# Altium schematic sheet TVR_Rev1.SchDoc
size 381 x 241 mm; SheetNumber: 1; SheetTotal: 1
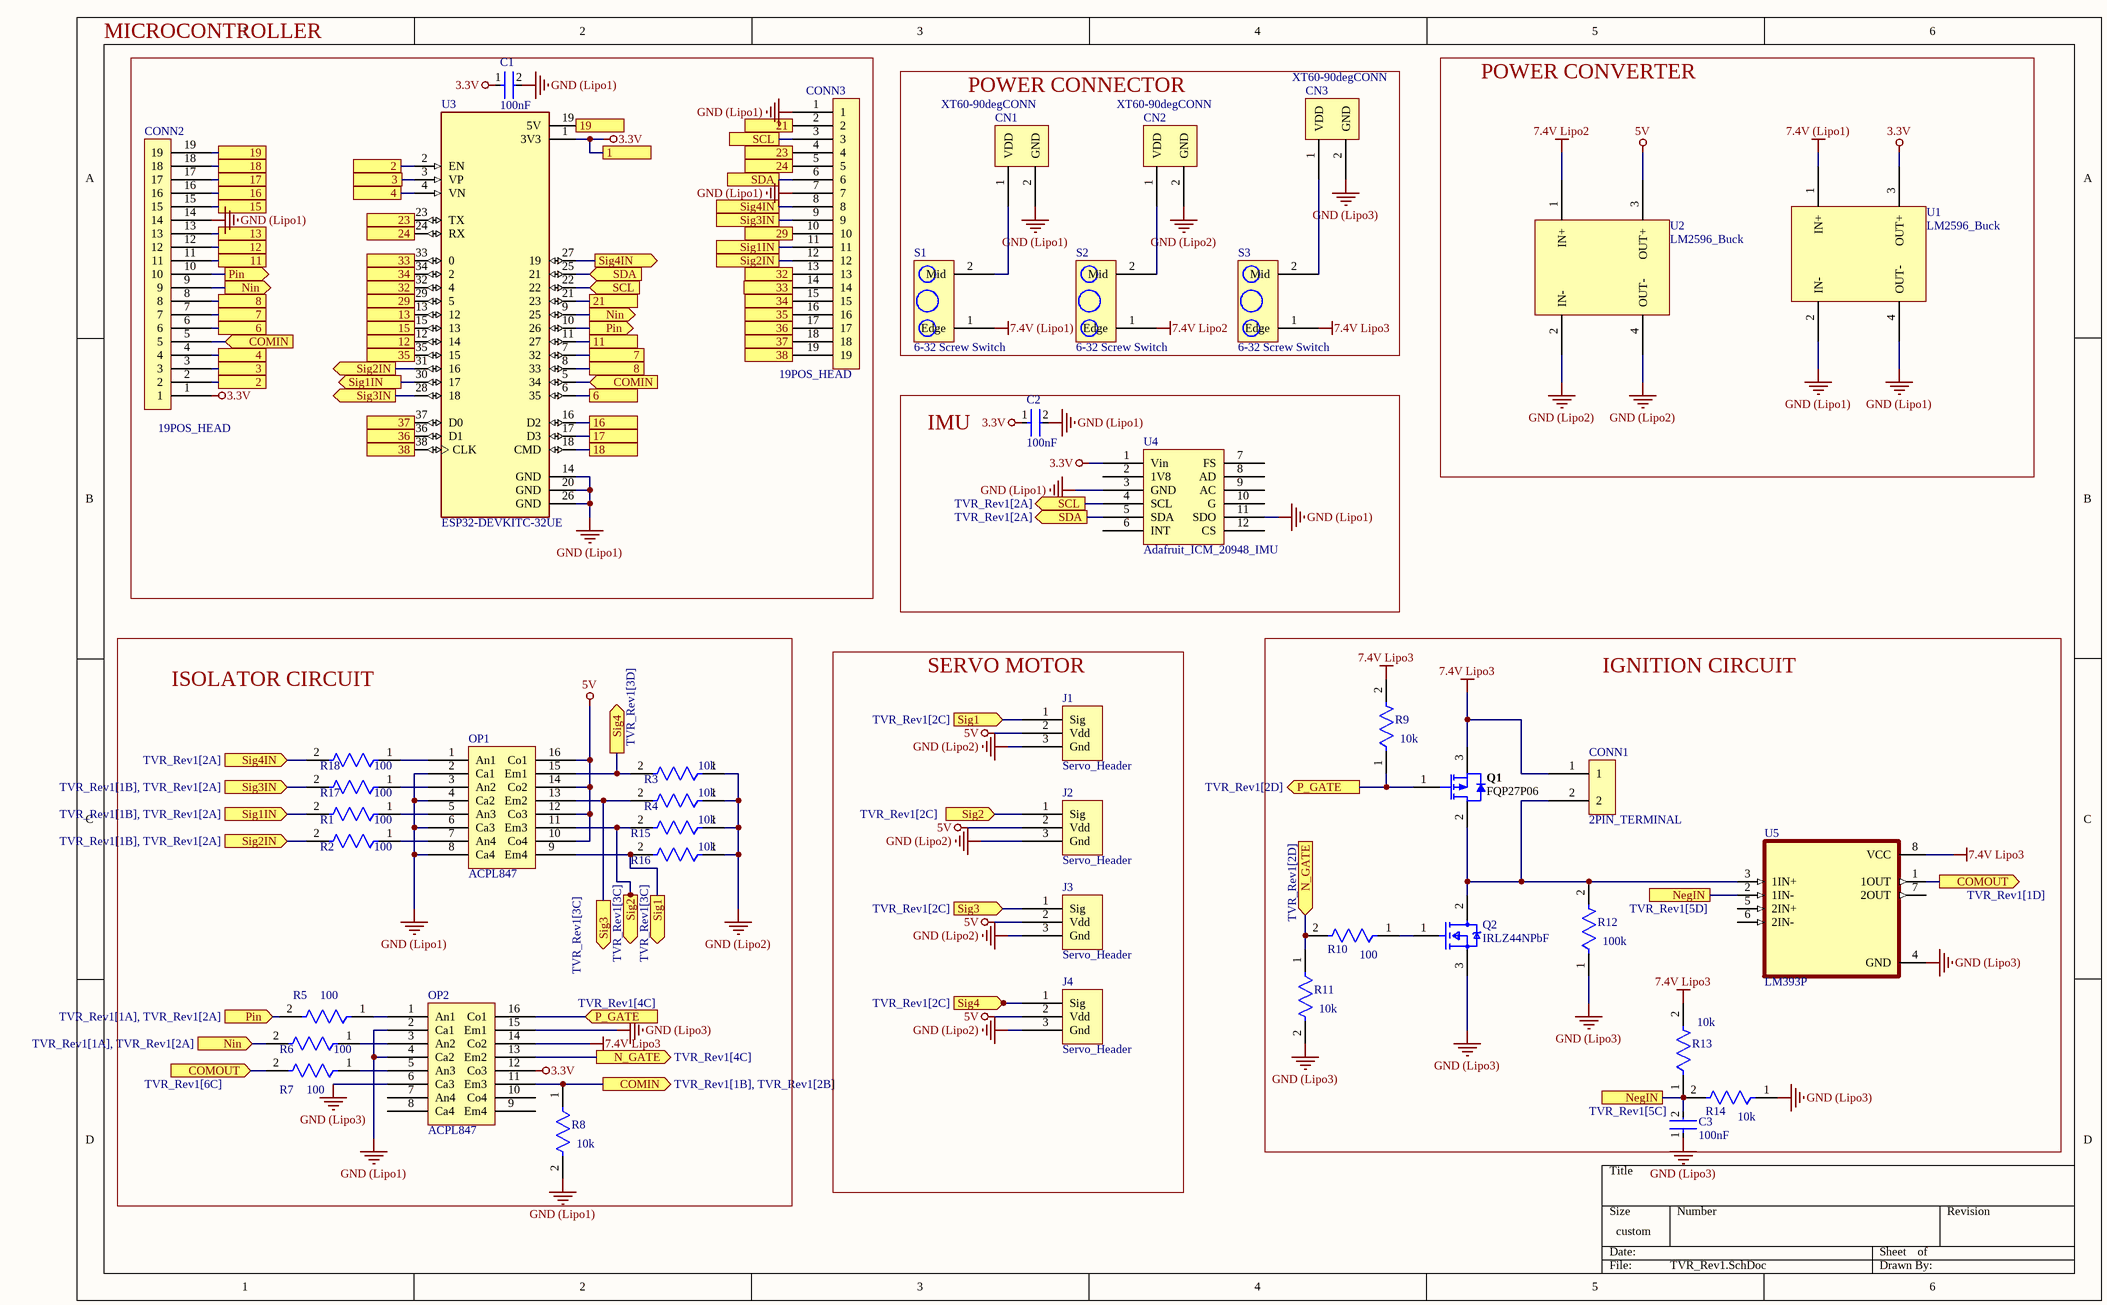
[diagram p0: TVR_Rev1.SchDoc]

## Parts
C1  100nF  [FP-RDE0M1-MFG]
C2  100nF  [FP-RDE0M1-MFG]
C3  100nF  [FP-RDE0M1-MFG]
CN1  XT60-90degCONN  [XT60-90CONN]
CN2  XT60-90degCONN  [XT60-90CONN]
CN3  XT60-90degCONN  [XT60-90CONN]
CONN1  2PIN_TERMINAL  [2PIN_TERMINAL]
CONN2  19POS_HEAD  [19POS_HEAD]
CONN3  19POS_HEAD  [19POS_HEAD]
J1  Servo_Header  [ServoHeader]
J2  Servo_Header  [ServoHeader]
J3  Servo_Header  [ServoHeader]
J4  Servo_Header  [ServoHeader]
OP1  ACPL847  [8PIN_DIP]
OP2  ACPL847  [8PIN_DIP]
Q1  FQP27P06  [FAIR-TO-220-3]
Q2  IRLZ44NPbF  [FP-PG-TO220-3-MFG]
R1  100  [FP-RLR07-MFG]
R2  100  [FP-RLR07-MFG]
R3  10k  [FP-RLR07-MFG]
R4  10k  [FP-RLR07-MFG]
R5  100  [FP-RLR07-MFG]
R6  100  [FP-RLR07-MFG]
R7  100  [FP-RLR07-MFG]
R8  10k  [FP-RLR07-MFG]
R9  10k  [FP-RLR07-MFG]
R10  100  [FP-RLR07-MFG]
R11  10k  [FP-RLR07-MFG]
R12  100k  [FP-RLR07-MFG]
R13  10k  [FP-RLR07-MFG]
R14  10k  [FP-RLR07-MFG]
R15  10k  [FP-RLR07-MFG]
R16  10k  [FP-RLR07-MFG]
R17  100  [FP-RLR07-MFG]
R18  100  [FP-RLR07-MFG]
S1  6-32 Screw Switch  [6-32 Screw Switch]
S2  6-32 Screw Switch  [6-32 Screw Switch]
S3  6-32 Screw Switch  [6-32 Screw Switch]
U1  LM2596_Buck  [LM2596 Buck]
U2  LM2596_Buck  [LM2596 Buck]
U3  ESP32-DEVKITC-32UE  [ESPRESSIF_ESP32-DEVKITC-32UE]
U4  Adafruit_ICM_20948_IMU  [Adafruit_ICM_20948_IMU]
U5  LM393P  [DIP794W45P254L959H508Q8]

## Blocks framed on the sheet
POWER CONNECTOR: CN1-CN3 S1-S3
POWER CONVERTER: U1 U2
IMU: C2 U4
ISOLATOR CIRCUIT: OP1 OP2 R1-R8 R15-R18
SERVO MOTOR: J1-J4
IGNITION CIRCUIT: C3 CONN1 Q1 Q2 R9-R14 U5

## Ports
1, 2 (see TVR_Rev1[1A]), 2 (see TVR_Rev1[1B]), 3 (see TVR_Rev1[1A]), 3 (see TVR_Rev1[1B]), 4 (see TVR_Rev1[1A]), 4 (see TVR_Rev1[1B]), 6 (see TVR_Rev1[1A]), 6 (see TVR_Rev1[2B]), 7 (see TVR_Rev1[1A]), 7 (see TVR_Rev1[2B]), 8 (see TVR_Rev1[1A]), 8 (see TVR_Rev1[2B]), 11 (see TVR_Rev1[1A]), 11 (see TVR_Rev1[2B]), 12 (see TVR_Rev1[1A]), 12 (see TVR_Rev1[1B]), 13 (see TVR_Rev1[1A]), 15 (see TVR_Rev1[1A]), 16 (see TVR_Rev1[1A]), 16 (see TVR_Rev1[2B]), 17 (see TVR_Rev1[1A]), 17 (see TVR_Rev1[2B]), 18 (see TVR_Rev1[1A]), 18 (see TVR_Rev1[2B]), 19 (see TVR_Rev1[1A]), 19 (see TVR_Rev1[2A]), 21 (see TVR_Rev1[2A]), 23 (see TVR_Rev1[1A]), 23 (see TVR_Rev1[2A]), 24 (see TVR_Rev1[1A]), 24 (see TVR_Rev1[2A]), 29 (see TVR_Rev1[1A]), 29 (see TVR_Rev1[2A]), 32 (see TVR_Rev1[1A]), 32 (see TVR_Rev1[2A]), 33 (see TVR_Rev1[1A]), 33 (see TVR_Rev1[2A]), 34 (see TVR_Rev1[1A]), 34 (see TVR_Rev1[2A]), 35 (see TVR_Rev1[1B]), 35 (see TVR_Rev1[2A]), 36 (see TVR_Rev1[1B]), 36 (see TVR_Rev1[2A]), 37 (see TVR_Rev1[1B]), 37 (see TVR_Rev1[2B]), 38 (see TVR_Rev1[1B]), 38 (see TVR_Rev1[2B]), COMIN (in, see TVR_Rev1[1B], TVR_Rev1[2D]), COMIN (in, see TVR_Rev1[2B], TVR_Rev1[2D]), COMIN (out, see TVR_Rev1[1B], TVR_Rev1[2B]), COMOUT (in, see TVR_Rev1[6C]), COMOUT (out, see TVR_Rev1[1D]), N_GATE (in, see TVR_Rev1[2D]), N_GATE (out, see TVR_Rev1[4C]), NegIN (see TVR_Rev1[5C]), NegIN (see TVR_Rev1[5D]), Nin (in, see TVR_Rev1[1A], TVR_Rev1[2A]), Nin (out, see TVR_Rev1[1A], TVR_Rev1[1D]), Nin (out, see TVR_Rev1[1D], TVR_Rev1[2A]), P_GATE (in, see TVR_Rev1[4C]), P_GATE (out, see TVR_Rev1[2D]), Pin (in, see TVR_Rev1[1A], TVR_Rev1[2A]), Pin (out, see TVR_Rev1[1A], TVR_Rev1[1D]), Pin (out, see TVR_Rev1[1D], TVR_Rev1[2A]), SCL (in, see TVR_Rev1[2A], TVR_Rev1[3B]), SCL (out, see TVR_Rev1[2A]), SCL (see TVR_Rev1[2A], TVR_Rev1[3B]), SDA (in, see TVR_Rev1[2A], TVR_Rev1[3B]), SDA (out, see TVR_Rev1[2A]), SDA (see TVR_Rev1[2A], TVR_Rev1[3B]), Sig1 (in, see TVR_Rev1[2C]), Sig1 (out, see TVR_Rev1[3C]), Sig1IN (in, see TVR_Rev1[1B], TVR_Rev1[2A]), Sig1IN (out, see TVR_Rev1[1C], TVR_Rev1[2A]), Sig1IN (see TVR_Rev1[1B], TVR_Rev1[1C]), Sig2 (in, see TVR_Rev1[2C]), Sig2 (out, see TVR_Rev1[3C]), Sig2IN (in, see TVR_Rev1[1B], TVR_Rev1[2A]), Sig2IN (out, see TVR_Rev1[1C], TVR_Rev1[2A]), Sig2IN (see TVR_Rev1[1B], TVR_Rev1[1C]), Sig3 (in, see TVR_Rev1[2C]), Sig3 (out, see TVR_Rev1[3C]), Sig3IN (in, see TVR_Rev1[1B], TVR_Rev1[2A]), Sig3IN (out, see TVR_Rev1[1C], TVR_Rev1[2A]), Sig3IN (see TVR_Rev1[1B], TVR_Rev1[1C]), Sig4 (in, see TVR_Rev1[2C]), Sig4 (out, see TVR_Rev1[3D]), Sig4IN (in, see TVR_Rev1[2A]), Sig4IN (out, see TVR_Rev1[1C], TVR_Rev1[2A]), Sig4IN (see TVR_Rev1[1C], TVR_Rev1[2A])

## Nets
3.3V: C1.1 C2.1 CONN2.1 OP2.12(Co3) U1.3(OUT+) U3.1(3V3) U4.1(Vin) ; port 1
5V: J1.2(Vdd) J2.2(Vdd) J3.2(Vdd) J4.2(Vdd) OP1.10(Co4) OP1.12(Co3) OP1.14(Co2) OP1.16(Co1) U2.3(OUT+)
7.4V (Lipo1): S1.1(Edge) U1.1(IN+)
7.4V Lipo2: S2.1(Edge) U2.1(IN+)
7.4V Lipo3: CONN1.1 OP2.14(Co2) Q1.3(S) R9.2 R13.2 S3.1(Edge) U5.8(VCC)
GND (Lipo1): C1.2 C2.2 CN1.2(GND) CONN2.14 CONN3.1 CONN3.7 OP1.2(Ca1) OP1.4(Ca2) OP1.6(Ca3) OP1.8(Ca4) OP2.2(Ca1) OP2.4(Ca2) R8.2 U1.2(IN-) U1.4(OUT-) U3.14(GND) U3.20(GND) U3.26(GND) U4.3(GND) U4.11(SDO)
GND (Lipo2): CN2.2(GND) J1.3(Gnd) J2.3(Gnd) J3.3(Gnd) J4.3(Gnd) R3.1 R4.1 R15.1 R16.1 U2.2(IN-) U2.4(OUT-)
GND (Lipo3): C3.1 CN3.2(GND) OP2.6(Ca3) OP2.15(Em1) Q2.3(S) R11.2 R12.1 R14.1 U5.4(GND)
2: CONN2.2 U3.2(EN) ; port 2
3: CONN2.3 U3.3(VP) ; port 3
4: CONN2.4 U3.4(VN) ; port 4
6: CONN2.6 U3.6(35) ; port 6
7: CONN2.7 U3.7(32) ; port 7
8: CONN2.8 U3.8(33) ; port 8
11: CONN2.11 U3.11(27) ; port 11
12: CONN2.12 U3.12(14) ; port 12
13: CONN2.13 U3.13(12) ; port 13
15: CONN2.15 U3.15(13) ; port 15
16: CONN2.16 U3.16(D2) ; port 16
17: CONN2.17 U3.17(D3) ; port 17
18: CONN2.18 U3.18(CMD) ; port 18
19: CONN2.19 U3.19(5V) ; port 19
21: CONN3.2 U3.21(23) ; port 21
23: CONN3.4 U3.23(TX) ; port 23
24: CONN3.5 U3.24(RX) ; port 24
29: CONN3.10 U3.29(5) ; port 29
32: CONN3.13 U3.32(4) ; port 32
33: CONN3.14 U3.33(0) ; port 33
34: CONN3.15 U3.34(2) ; port 34
35: CONN3.16 U3.35(15) ; port 35
36: CONN3.17 U3.36(D1) ; port 36
37: CONN3.18 U3.37(D0) ; port 37
38: CONN3.19 U3.38(CLK) ; port 38
COMIN: CONN2.5 OP2.11(Em3) R8.1 U3.5(34) ; port COMIN
COMOUT: R7.2 U5.1(1OUT) ; port COMOUT
N_GATE: OP2.13(Em2) R10.2 R11.1 ; port N_GATE
NegIN: C3.2 R13.1 R14.2 U5.2(1IN-) ; port NegIN
Nin: CONN2.9 R6.2 U3.9(25) ; port Nin
P_GATE: OP2.16(Co1) Q1.1(G) R9.1 ; port P_GATE
Pin: CONN2.10 R5.2 U3.10(26) ; port Pin
SCL: CONN3.3 U3.22 U4.4(SCL) ; port SCL
SDA: CONN3.6 U3.25(21) U4.5(SDA) ; port SDA
Sig1: J1.1(Sig) OP1.9(Em4) R16.2 ; port Sig1
Sig1IN: CONN3.11 R1.2 U3.30(17) ; port Sig1IN
Sig2: J2.1(Sig) OP1.11(Em3) R15.2 ; port Sig2
Sig2IN: CONN3.12 R2.2 U3.31(16) ; port Sig2IN
Sig3: J3.1(Sig) OP1.13(Em2) R4.2 ; port Sig3
Sig3IN: CONN3.9 R17.2 U3.28(18) ; port Sig3IN
Sig4: J4.1(Sig) OP1.15(Em1) R3.2 ; port Sig4
Sig4IN: CONN3.8 R18.2 U3.27(19) ; port Sig4IN
NetCN1_1: CN1.1(VDD) S1.2(Mid)
NetCN2_1: CN2.1(VDD) S2.2(Mid)
NetCN3_1: CN3.1(VDD) S3.2(Mid)
NetCONN1_2: CONN1.2 Q1.2(D) Q2.2(D) R12.2 U5.3(1IN+)
NetOP1_1: OP1.1(An1) R18.1
NetOP1_3: OP1.3(An2) R17.1
NetOP1_5: OP1.5(An3) R1.1
NetOP1_7: OP1.7(An4) R2.1
NetOP2_1: OP2.1(An1) R5.1
NetOP2_3: OP2.3(An2) R6.1
NetOP2_5: OP2.5(An3) R7.1
NetQ2_1: Q2.1(G) R10.1

Not connected (* = marked no-connect by the designer): OP2 7(An4) 8(Ca4) 9(Em4) 10(Co4); U4 2(1V8) 6(INT) 7(FS) 8(AD) 9(AC) 10(G) 12(CS); U5 5(2IN+) 6(2IN-) 7(2OUT)

## Notes on the sheet
- MICROCONTROLLER

## Library data of the parts
C1-C3 = CMP-06035-051680-1: Ceramic Capacitor 100nF ±10% 50V X7R Radial; Lead/Base Style: Kinked; Lead Diameter: 0.5mm; Lead Free: Lead Free; Mount: Through Hole; Package Quantity: 2000; Lead Pitch: 0.197inch; Capacitance: 100nF; Case/Package: Radial; Tolerance: 10%; Height - Seated (Max): 0.236inch; Max Operating Temperature: 125°C; Dielectric: X7R; Min Operating Temperature: -55°C; Voltage Rating (DC): 50V; Voltage Rating: 50V; Termination: Radial; Height: 3.5mm; Resistor Type: Ceramic; Width: 3.5mm; Packaging: Tape and Reel; Length: 0.157inch
Q1 = CMP-2000-04936-1: P-Channel QFET(R) MOSFET, -60 V, -27 A, -55 to 175 degC, 3-Pin TO-220, RoHS, Tube; Manufacturer: Fairchild; Rated Power Dissipation: 120W; Qg Gate Charge: 33nC; Drain-Source On Resistance-Max: 0.07O; Drain-to-Source Voltage [Vdss]: 60V; Package Reference: TO-220; Datasheet URL: https://www.fairchildsemi.com/datasheets/FQ/FQP27P06.pdf; Datasheet Version: Mar-13; Package Description: 3-Pin Through Hole Device, Body 10 x 4.5 mm, Pitch 2.54 mm; Package URL: https://www.fairchildsemi.com/package-drawings/TO/TO220B03.pdf; Channel Type: P-Channel; Manufacturer URL: https://www.fairchildsemi.com/
Q2 = CMP-32901-000488-1: MOSFET N-CH 55V 47A TO220AB; Turn-On Delay Time: 11ns; Gate to Source Voltage (Vgs): 16V; Element Configuration: Single; Rds On Max: 22mR; Turn-Off Delay Time: 26ns; Max Power Dissipation: 110W; Threshold Voltage: 2V; Drain to Source Resistance: 35mR; Input Capacitance: 1.7nF; Continuous Drain Current (ID): 47A; Case/Package: TO-220; Lead Free: Lead Free; Halogen Free: Halogen Free; Packaging: Rail/Tube; Length: 0.414inch; Min Operating Temperature: -55°C; REACH SVHC: No SVHC; Number of Pins: 3; Width: 0.185inch; Drain to Source Voltage (Vdss): 55V; Power Dissipation: 110W; RoHS Compliant: Yes; Max Operating Temperature: 175°C; Height: 0.6inch; Max Dual Supply Voltage: 55V; Drain to Source Breakdown Voltage: 55V; Mount: Through Hole
R1-R18 = CMP-00030-39447724-1: RLR07C1001FSB14 Fixed Resistor, Metal Film, 0.25W, 1000ohm, 250V, 1% +/-Tol, 100ppm/Cel, Through Hole Mount; Wire/Cable Diameter: 50.8µm; Lead Diameter: 640µm; Max Power Dissipation: 250mW; Temperature Coefficient: 100ppm/°C; Resistance: 1kΩ; Lead Length: 38.1mm; Voltage Rating: 250V; Lead Free: Contains Lead; REACH SVHC: Unknown; Packaging: Bulk; Military Standard: MIL-PRF-39017; Width: 2.29mm; Max Operating Temperature: 150°C; Length: 7.62mm; Min Operating Temperature: -65°C; Composition: Metal Film; Diameter: 2.29mm; Radiation Hardening: No; Features: Military, Moisture Resistant, Weldable; Failure Rate: 0.001%; Case/Package: Conformal; Tolerance: 1%; Voltage Rating (DC): 250V; Schedule B: 8533210090, 8533210090; RoHS: Non-Compliant; Termination: Axial; Power Rating: 250mW; Contact Plating: Lead, Tin; NexarPartId: 39447724; Number of Terminations: 2; Number of Pins: 14
U1 U2 = LM2596_Buck: buck converter breakout
U3 = ESP32-DEVKITC-32UE: ESP32-WROOM-32UE series Transceiver; 802.11 b/g/n (Wi-Fi, WiFi, WLAN), BluetoothÂ® Smart Ready 4.x Dual Mode Evaluation Board; MF: Espressif Systems; Package: None; Price: None; MP: ESP32-DEVKITC-32UE; Availability: In Stock; Value: *; Check_prices: https://www.snapeda.com/parts/ESP32-DEVKITC-32UE/Espressif+Systems/view-part/?ref=eda; Purchase-URL: https://pricing.snapeda.com/search/part/ESP32-DEVKITC-32UE/?ref=eda; SnapEDA_Link: https://www.snapeda.com/parts/ESP32-DEVKITC-32UE/Espressif+Systems/view-part/?ref=snap
U5 = LM393P: Dual differential comparator, commercial grade 8-PDIP 0 to 70; MF: Texas Instruments; Availability: Unavailable; Value: *; Texas_Instruments-Purchase-URL: https://snapeda.com/shop?store=Texas+Instruments&id=46802; Package: PDIP-8 Texas Instruments; Price: None; SnapEDA_Link: https://www.snapeda.com/parts/LM393P/Texas%20Instruments/view-part/46802/?ref=snap; MP: LM393P; BuyPart: https://www.snapeda.com/parts/LM393P/Texas%20Instruments/view-part/46802/?ref=eda